# Altium schematic sheet 2_STM32F4.SchDoc
size Letter
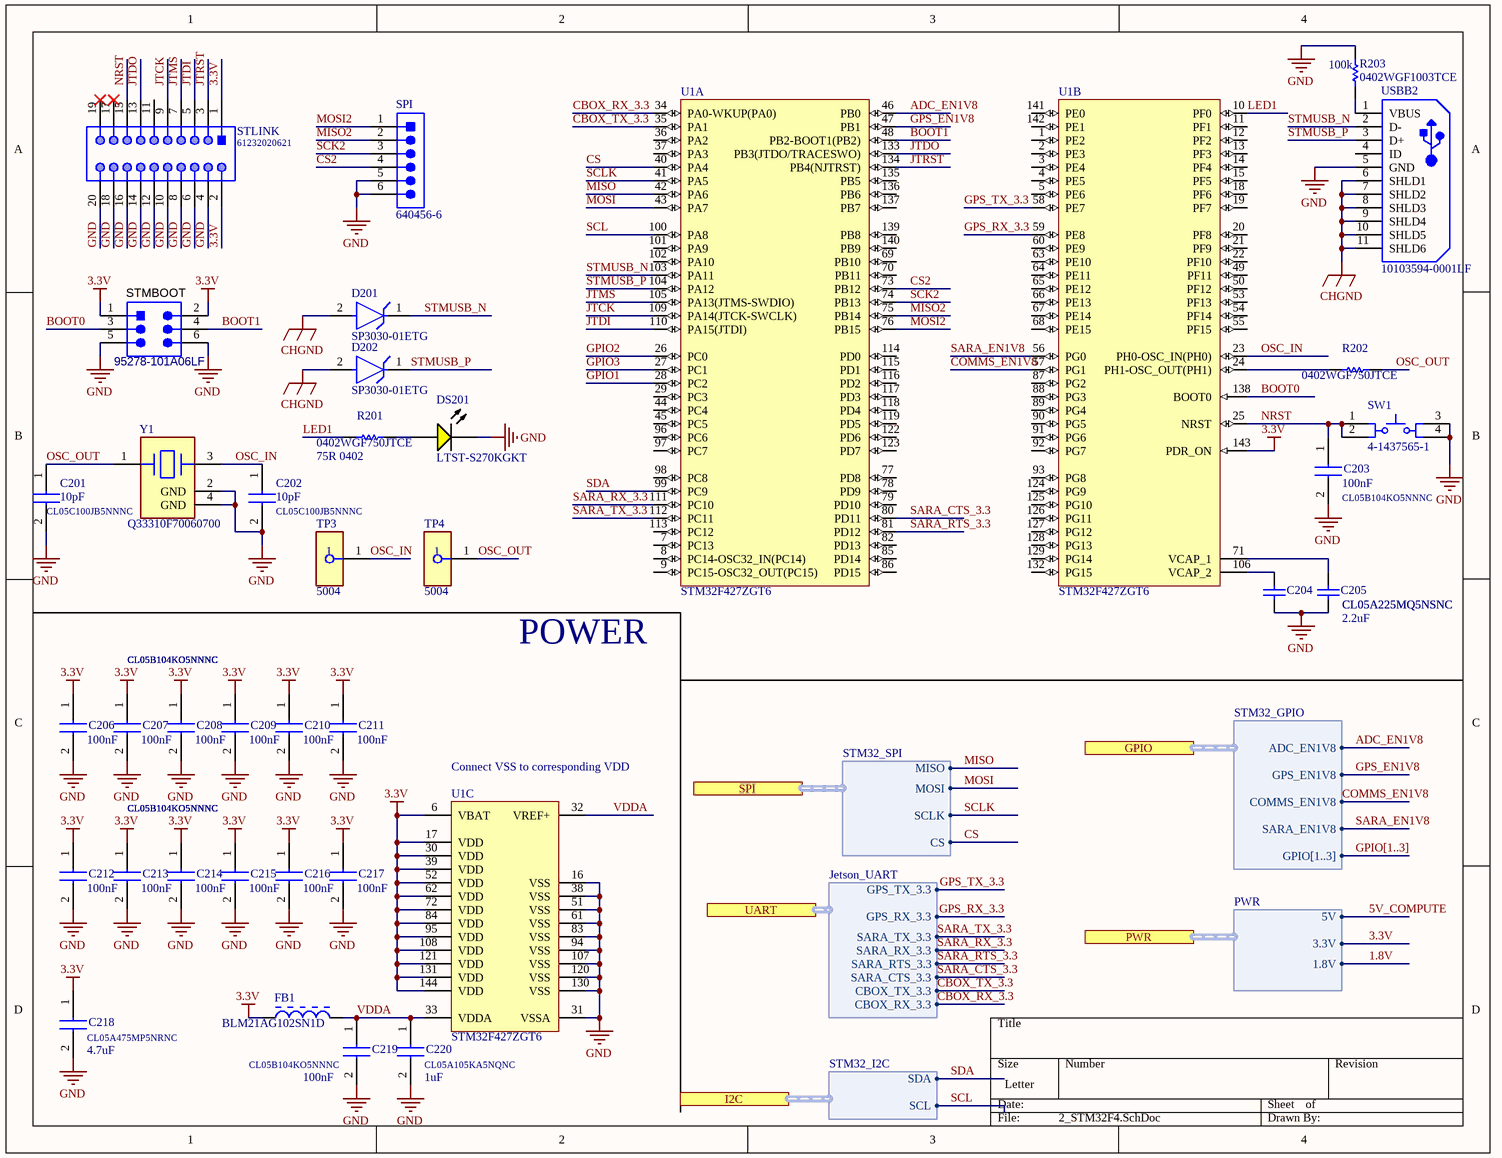
[diagram p0: 2_STM32F4.SchDoc]

## Parts
C201  CL05C100JB5NNNC  value 10pF  [CAPC1005X55N]
C202  CL05C100JB5NNNC  value 10pF  [CAPC1005X55N]
C203  CL05B104KO5NNNC  value 100nF  [CAPC1005X55N]
C204  CL05A225MQ5NSNC  [0402]
C205  CL05A225MQ5NSNC  [0402]
C206  CL05B104KO5NNNC  value 100nF  [CAPC1005X55N]
C207  CL05B104KO5NNNC  value 100nF  [CAPC1005X55N]
C208  CL05B104KO5NNNC  value 100nF  [CAPC1005X55N]
C209  CL05B104KO5NNNC  value 100nF  [CAPC1005X55N]
C210  CL05B104KO5NNNC  value 100nF  [CAPC1005X55N]
C211  CL05B104KO5NNNC  value 100nF  [CAPC1005X55N]
C212  CL05B104KO5NNNC  value 100nF  [CAPC1005X55N]
C213  CL05B104KO5NNNC  value 100nF  [CAPC1005X55N]
C214  CL05B104KO5NNNC  value 100nF  [CAPC1005X55N]
C215  CL05B104KO5NNNC  value 100nF  [CAPC1005X55N]
C216  CL05B104KO5NNNC  value 100nF  [CAPC1005X55N]
C217  CL05B104KO5NNNC  value 100nF  [CAPC1005X55N]
C218  CL05A475MP5NRNC  value 4.7uF  [CAPC1005X55N]
C219  CL05B104KO5NNNC  value 100nF  [CAPC1005X55N]
C220  CL05A105KA5NQNC  value 1uF  [CAPC1005X55N]
D201  SP3030-01ETG  [FP-SP3030-MFG]
D202  SP3030-01ETG  [FP-SP3030-MFG]
DS201  LTST-S270KGKT  [AVAG-HSMX-C190_V]
FB1  BLM21AG102SN1D  [MURA-BLM21-H1-CHIP-2_V]
R201  0402WGF750JTCE  [RESC1005X40X25ML05T10]
R202  0402WGF750JTCE  [RESC1005X40X25ML05T10]
R203  0402WGF1003TCE  [0402]
SPI  640456-6  [TECO-640456-6_V]
STLINK  61232020621  [61232020621]
STMBOOT  95278-101A06LF  [AMPM-95278-101A06LF_V]
SW1  4-1437565-1  [TECO-4-1437565-1_V]
TP3  5004  [FP-5004-MFG]
TP4  5004  [FP-5004-MFG]
U1  STM32F427ZGT6  [STM-LQFP144_V]  (parts A,B,C of 3)
USBB2  10103594-0001LF  [FCI-10103594-0001LF_V]
Y1  Q33310F70060700  [FP-7M-MFG]

## Ports
GPIO (harness STM32_GPIO), I2C (harness STM32_I2C), PWR (harness PWR), SPI (harness STM32_SPI), UART (harness Jetson_UART)

## Harnesses
STM32_I2C: SDA, SCL
STM32_SPI: MISO, MOSI, SCLK, CS
STM32_GPIO: ADC_EN1V8, GPS_EN1V8, COMMS_EN1V8, SARA_EN1V8, GPIO[1..3]
PWR: 5V, 3.3V, 1.8V
Jetson_UART: GPS_TX_3.3, GPS_RX_3.3, SARA_TX_3.3, SARA_RX_3.3, CBOX_TX_3.3, CBOX_RX_3.3, SARA_RTS_3.3, SARA_CTS_3.3

## Nets
3.3V: C206.1 C207.1 C208.1 C209.1 C210.1 C211.1 C212.1 C213.1 C214.1 C215.1 C216.1 C217.1 C218.1 FB1.1 STLINK.1 STLINK.2 STMBOOT.1 STMBOOT.2 U1.6(VBAT) U1.17(VDD) U1.30(VDD) U1.39(VDD) U1.52(VDD) U1.62(VDD) U1.72(VDD) U1.84(VDD) U1.95(VDD) U1.108(VDD) U1.121(VDD) U1.131(VDD) U1.143(PDR_ON) U1.144(VDD) ; port PWR.3.3V
CHGND: D201.2(A) D202.2(A) USBB2.6(SHLD1) USBB2.7(SHLD2) USBB2.8(SHLD3) USBB2.9(SHLD4) USBB2.10(SHLD5) USBB2.11(SHLD6)
GND: C201.2 C202.2 C203.2 C204.1 C205.1 C206.2 C207.2 C208.2 C209.2 C210.2 C211.2 C212.2 C213.2 C214.2 C215.2 C216.2 C217.2 C218.2 C219.2 C220.2 DS201.2(K) R203.2 SPI.5 SPI.6 STLINK.4 STLINK.6 STLINK.8 STLINK.10 STLINK.12 STLINK.14 STLINK.16 STLINK.18 STLINK.20 STMBOOT.5 STMBOOT.6 SW1.3 SW1.4 U1.16(VSS) U1.31(VSSA) U1.38(VSS) U1.51(VSS) U1.61(VSS) U1.83(VSS) U1.94(VSS) U1.107(VSS) U1.120(VSS) U1.130(VSS) USBB2.5(GND) Y1.2(GND) Y1.4(GND)
1.8V: port PWR.1.8V
5V_COMPUTE: port PWR.5V
ADC_EN1V8: U1.46(PB0) ; port GPIO.ADC_EN1V8
BOOT0: STMBOOT.3 U1.138(BOOT0)
BOOT1: STMBOOT.4 U1.48(PB2-BOOT1(PB2))
CBOX_RX_3.3: U1.34(PA0-WKUP(PA0)) ; port UART.CBOX_RX_3.3
CBOX_TX_3.3: U1.35(PA1) ; port UART.CBOX_TX_3.3
COMMS_EN1V8: U1.57(PG1) ; port GPIO.COMMS_EN1V8
CS: U1.40(PA4) ; port SPI.CS
CS2: SPI.4 U1.73(PB12)
GPIO1: U1.28(PC2)
GPIO2: U1.26(PC0)
GPIO3: U1.27(PC1)
GPS_EN1V8: U1.47(PB1) ; port GPIO.GPS_EN1V8
GPS_RX_3.3: U1.59(PE8) ; port UART.GPS_RX_3.3
GPS_TX_3.3: U1.58(PE7) ; port UART.GPS_TX_3.3
JTCK: STLINK.9 U1.109(PA14(JTCK-SWCLK))
JTDI: STLINK.5 U1.110(PA15(JTDI))
JTDO: STLINK.13 U1.133(PB3(JTDO/TRACESWO))
JTMS: STLINK.7 U1.105(PA13(JTMS-SWDIO))
JTRST: STLINK.3 U1.134(PB4(NJTRST))
LED1: R201.2 U1.10(PF0)
MISO: U1.42(PA6) ; port SPI.MISO
MISO2: SPI.2 U1.75(PB14)
MOSI: U1.43(PA7) ; port SPI.MOSI
MOSI2: SPI.1 U1.76(PB15)
NRST: C203.1 STLINK.15 SW1.1 SW1.2 U1.25(NRST)
OSC_IN: C202.1 TP3.1 U1.23(PH0-OSC_IN(PH0)) Y1.3
OSC_OUT: C201.1 R202.1 TP4.1 Y1.1
SARA_CTS_3.3: U1.80(PD11) ; port UART.SARA_CTS_3.3
SARA_EN1V8: U1.56(PG0) ; port GPIO.SARA_EN1V8
SARA_RTS_3.3: U1.81(PD12) ; port UART.SARA_RTS_3.3
SARA_RX_3.3: U1.111(PC10) ; port UART.SARA_RX_3.3
SARA_TX_3.3: U1.112(PC11) ; port UART.SARA_TX_3.3
SCK2: SPI.3 U1.74(PB13)
SCL: U1.100(PA8) ; port I2C.SCL
SCLK: U1.41(PA5) ; port SPI.SCLK
SDA: U1.99(PC9) ; port I2C.SDA
STMUSB_N: D201.1(C) U1.103(PA11) USBB2.2(D-)
STMUSB_P: D202.1(C) U1.104(PA12) USBB2.3(D+)
VDDA: C219.1 C220.1 FB1.2 U1.32(VREF+) U1.33(VDDA)
NetC204_2: C204.2 U1.106(VCAP_2)
NetC205_2: C205.2 U1.71(VCAP_1)
NetDS201_1: DS201.1(A) R201.1
NetR202_2: R202.2 U1.24(PH1-OSC_OUT(PH1))
NetR203_1: R203.1 USBB2.1(VBUS)

Not connected (* = marked no-connect by the designer): STLINK 11 17* 19*; U1 1(PE2) 2(PE3) 3(PE4) 4(PE5) 5(PE6) 7(PC13) 8(PC14-OSC32_IN(PC14)) 9(PC15-OSC32_OUT(PC15)) 11(PF1) 12(PF2) 13(PF3) 14(PF4) 15(PF5) 18(PF6) 19(PF7) 20(PF8) 21(PF9) 22(PF10) 29(PC3) 36(PA2) 37(PA3) 44(PC4) 45(PC5) 49(PF11) 50(PF12) 53(PF13) 54(PF14) 55(PF15) 60(PE9) 63(PE10) 64(PE11) 65(PE12) 66(PE13) 67(PE14) 68(PE15) 69(PB10) 70(PB11) 77(PD8) 78(PD9) 79(PD10) 82(PD13) 85(PD14) 86(PD15) 87(PG2) 88(PG3) 89(PG4) 90(PG5) 91(PG6) 92(PG7) 93(PG8) 96(PC6) 97(PC7) 98(PC8) 101(PA9) 102(PA10) 113(PC12) 114(PD0) 115(PD1) 116(PD2) 117(PD3) 118(PD4) 119(PD5) 122(PD6) 123(PD7) 124(PG9) 125(PG10) 126(PG11) 127(PG12) 128(PG13) 129(PG14) 132(PG15) 135(PB5) 136(PB6) 137(PB7) 139(PB8) 140(PB9) 141(PE0) 142(PE1); USBB2 4(ID)

## Buses and harness runs
bus GPIO[1..3]

## Notes on the sheet
- (near R203) 100k
- (near R201) 75R 0402
- (near C205) 2.2uF
- POWER
- (near U1) Connect VSS to corresponding VDD

## Library data of the parts
C201 C202 = C0402C560K5RACTU: 10pF 0402; Manufacturer_Name: Kemet; Datasheet Link: https://content.kemet.com/datasheets/KEM_C1002_X7R_SMD.pdf; Height: 0.55mm; Manufacturer_Part_Number: C0402C560K5RACTU; Arrow Part Number: C0402C560K5RACTU; Mouser Part Number: 80-C0402C560K5RACTU; Mouser Price/Stock: https://www.mouser.co.uk/ProductDetail/KEMET/C0402C560K5RACTU?qs=gt1LBUVyoHmQZW5v3ySgNQ%3D%3D
C203 C206-C220 = C0402C560K5RACTU: 100nF 0402; Manufacturer_Name: Kemet; Datasheet Link: https://content.kemet.com/datasheets/KEM_C1002_X7R_SMD.pdf; Height: 0.55mm; Manufacturer_Part_Number: C0402C560K5RACTU; Arrow Part Number: C0402C560K5RACTU; Mouser Part Number: 80-C0402C560K5RACTU; Mouser Price/Stock: https://www.mouser.co.uk/ProductDetail/KEMET/C0402C560K5RACTU?qs=gt1LBUVyoHmQZW5v3ySgNQ%3D%3D
C204 C205 = Cap: 2.2uF 0402; Published: 8-Jun-2000; LatestRevisionDate: 17-Jul-2002; LatestRevisionNote: Re-released for DXP Platform.; PackageReference: RAD-0.3; Publisher: Altium Limited; PackageDescription: Radial Cap, Thru-Hole; 2 Leads; 0.3 in Pin Spacing
D201 D202 = CMP-08607-000070-1: TVS DIODE 5V 10V SOD882; Manufacturer: Littelfuse; Max Junction Temp: +150°C; Automotive Grade: Grade 1; Direction: Unidirectional; Peak Pulse Current: 3A; Capacitance: 0.5pF; Value: 0.5pF; Number Of Channels: 1; Manufacturer Part Number: SP3030-01ETG; Temperature Range Low: -40°C; Lead Free: Yes; Package: SP3030; Device Class L2: TVS Diodes; Height: 0.6mm; ComponentLink2URL: https://www.littelfuse.com/~/media/electronics/datasheets/tvs_diode_arrays/littelfuse_tvs_diode_array_sp3030_datasheet.pdf.pdf; Device Class L3: unset; Category: Diode; Reverse Standoff Voltage: 5V; RoHS: TRUE; Digikey Description: TVS DIODE 5V 10V SOD882; Octopart: https://octopart.com/sp3030-01etg-littelfuse-29687287; ComponentLink2Description: Datasheet; Device Class L1: Circuit Protection; Automotive: Yes; Temperature: -40°C to +125°C; Temperature Range High: +125°C; Clamping Voltage: 10V; Mouser Description: TVS Diodes / ESD Suppressors 5V 1uA 22kV UNIDIRECTIONAL
DS201 = CMP-1744-00003-1: LED Uni-Color Yellow, 65 mW, 20 mA, -40 to 85 degC, 2-Pin SMD, RoHS, Tape and Reel; Tolerance: 1%; Voltage Rating: 50 V; Power Rating: 100 mW; Case\Package: 0603; Resistance: 390 Ohm; Min Operating Temperature: -55 degC; Length: 1.6 mm; ComponentLink3Description: Package Specification; Mount: Surface Mount; PackageReference: HSMX-C190; ComponentLink2Description: Datasheet; DatasheetVersion: Mar-12; Case Code (Metric): 1608; Pins: 2; Package Quantity: 5000; ComponentLink2URL: http://docs.avagotech.com/docs/AV02-0551EN; ComponentLink1Description: Manufacturer URL; RoHSCompliant: true; Packaging: Tape and Reel; PackageDescription: 2-Pin Surface Mount Device, Body 1.6 x 0.8 mm, Height 0.9 mm; REACH SVHC: No SVHC; ComponentLink3URL: http://www.fairchildsemi.com/dwg/MA/MA03D.pdf; Voltage Rating (DC): 50 V; Width: 0.8 mm; ComponentLink1URL: http://www.avagotech.com/; Max Operating Temperature: 155 degC; Case Code (Imperial): 0603; Height: 0.45 mm
FB1 = CMP-0686-00665-2: Chip Ferrite Bead for General Signal lines, 1000 Ohm, 500 mA, -55 to 125 degC, 2 x 1.25 x 1.05 mm SMD, Tape and Reel; Manufacturer: Murata; Impedance (at 100 MHz): 1000 Ohm +/- 25%; DC Resistance: 0.28 Ohm Max.; Rated Current: 500 mA; ComponentLink1Description: Manufacturer URL; PackageDescription: 2-Pin Chip, Body 2 x 1.25 mm; DatasheetVersion: 08/2013; PartNumber: BLM21AG102SN1D; Mounting Technology: Surface Mount; Operating Temperature Range: -55 to 125 degC; ComponentLink2URL: http://www.murata.com/products/catalog/pdf/c31e.pdf; ComponentLink3Description: Package Specification; ComponentLink2Description: Datasheet; Packing: Tape and Reel; ComponentLink3URL: http://www.murata.com/products/catalog/pdf/c31e.pdf; ComponentLink1URL: http://www.murata.com/; PackageReference: BLM21_H1050-2
R201 = CMP-2002-07344-1: 75R 0402; Part Number: RC0402FR-07100RL; Manufacturer: Yageo / Phycomp
R202 = CMP-2002-07344-1: 22R 0402; Part Number: RC0402FR-07100RL; Manufacturer: Yageo / Phycomp
R203 = Res1: 100k 0402; Published: 8-Jun-2000; LatestRevisionDate: 17-Jul-2002; LatestRevisionNote: Re-released for DXP Platform.; PackageReference: AXIAL-0.3; Publisher: Altium Limited; PackageDescription: Axial Device, Thru-Hole; 2 Leads; 0.3 in Pin Spacing
SPI = CMP-2000-05661-1: Male Header, Pitch 2.54 mm, 1 x 6 Position, Height 10.03 mm, Tail Length 3.56 mm, -55 to 105 degC, Bulk; Manufacturer: TE Connectivity; Contact Centerline Spacing: 0.100 / in.; Number of Contacts: 6; Current, Rating: 5 / A; Agency Approvals: CSA,UL; Material, Contact: CopperAlloy; Mounting Hole Size: 0.04 / "; Brand/Series: MTA-100Series; Pin Spacing: 0.1 / "; Mount Angle: Vertical; Contact Termination Area Plating: Tin; Angle: Straight; Primary Type: InterconnectSystem; Standards: RoHSCompliant,ELVCompliant,UL94V-0; Temperature, Operating: -55to+105 / °C; Material, Housing: Polyester; Special Features: Pinstrip; Color, Housing: White; Connector Type: MTA-100; Voltage, Rating: 250 / V; Termination: Solder; Package Reference: 640456-6; Size, Post: 0.025 / in.; Color: White; Datasheet URL: https://datasheet.ciiva.com/25618/0900766b80eb7fdd-25618163.pdf; Manufacturer URL: http://www.te.com/; Mounting Type: PCMount; Length, Pin: 0.14 / "; Type: PCBPlug; Length, Overall: 0.6 / "; Mounting Technology: ThroughHole; Number of Rows: 1; Contact Shape: Square; Contact Mating Area Plating: Tin; Datasheet Version: Rev. W, 05/2005; Number of Positions: 6; Package Description: Male Header, Pitch 2.54 mm, 1 x 6 Position, Height 10.03 mm, Tail Length 3.56 mm; Contact Plating: Tin; Length, Terminal Post: 0.14 / in.; Flammability Rating: UL94V-0
STLINK = CMP-1502-00063-1: Male Box Header WR-BHD, SMT, Vertical, pitch 2.54 mm, 20 pins; Manufacturer: Wurth Elektronik; Withstanding Voltage: 500VAC; Working Voltage: 250VAC; Pin Number: 20; Contact Resistance: 20mOhm; Pitch: 2.54mm; Datasheet URL: https://katalog.we-online.de/em/datasheet/6123xx20621.pdf; Gender: Male; Packaging: TapeandReel; Operating Temperature: -40to125degC; Mounting Technology: SMT; Orientation: Vertical; Published Date: August2018; Part Number: 61232020621; Manufacturer URL: http://www.we-online.de; Package Reference: 61232020621; Publisher: WurthElektronik
STMBOOT = CMP-1743-00002-1: Male Header, Pitch 2.54 mm, 2 x 3 Position, Height 14.4 mm, RoHS, Tape and Reel; Power Rating: 100 mW; Tolerance: 1%; Resistance: 49.9 Ohm; Case\Package: 0603; Voltage Rating: 50 V; DatasheetVersion: Rev. AC, 03/2016; PackageDescription: Male Header, Pitch 2.54 mm, 2 x 3 Position, Height 14.4 mm; REACH SVHC: No SVHC; Height: 0.45 mm; Mount: Surface Mount; Case Code (Imperial): 0603; Max Operating Temperature: 155 degC; Case Code (Metric): 1608; Packaging: Tape and Reel; RoHSCompliant: true; ComponentLink1Description: Datasheet; Min Operating Temperature: -55 degC; Length: 1.6 mm; Width: 0.8 mm; ComponentLink1URL: http://portal.fciconnect.com/Comergent//fci/drawing/95278.pdf; PackageReference: 95278-101A06LF
SW1 = CMP-2000-05602-1: Tactile Switch, 50 mA, 12 VDC, -20 to 85 degC, 4-Pin SMD, RoHS, Bulk; Manufacturer: TEConnectivity/AMPBrand; Illumination Type: N/R; Maximum Contact Resistance: 100mOhm; Actuator Style: RoundButton; Actuator Length: 1.4mm; Contact Rating @ Voltage: 0.05@12VDCA; Maximum DC Voltage Rating: 12V; Body Orientation: Straight; Ground Terminal: No; Dielectric Strength: 500VAC; Operating Force: 1.57N; Electrical Life: 100000Cycle; Mechanical Life: N/A; Family: FSMJSMA; Contact Material: CopperAlloy; Type: N/A; RoHS: Yes; Pole Throw Configuration: N/A; Operating Temperature: -20to85C; Minimum Insulation Resistance: 100MOhm; Package Description: 4-Pin Surface Mount Device, Body 6 x 6 mm, Pitch 9.1 mm; Housing Material: N/A; Switch Configuration: N/A; Mounting: SurfaceMount,GullWing; Datasheet URL: https://datasheet.ciiva.com/14635/0900766b80912216-14635826.pdf; Packaging: Bulk; Base Material: N/A; Actuator Color: N/A; Dimension: 6x10x5.25mm; Contact Plating: Silver; Seal Location: N/A; Mounting Technology: SurfaceMount; Part No: 4-1437565-1; Seal Description: N/A; Maximum AC Voltage Rating: N/A; Datasheet Version: 04/2007; Manufacturer URL: http://www.te.com/; Package Reference: 4-1437565-1; Product Weight: N/A
TP3 TP4 = CMP-2000-05575-2: PC TEST POINT MINIATURE YELLOW; Manufacturer: Keystone; Number Of Contacts: 1; Is Female: yes; Device Class L1: Connectors; Manufacturer Part Number: 5004; Digikey Description: PC TEST POINT MINIATURE YELLOW; ComponentLink2URL: https://www.keyelco.com/product-pdf.cfm?p=1313; Lead Free: Yes; ComponentLink2Description: Datasheet; Category: Conn; Height: 4.72mm; Octopart: https://octopart.com/5004-keystone-28591; Mouser Description: TEST POINT PC MINI .040"D YELLOW; Device Class L3: unset; Contact Material: Silver; Package: 5004; Automotive: No; Device Class L2: unset; RoHS: TRUE
U1 = CMP-0243-00054-2: ARM Cortex-M4 32-bit MCU+FPU, 210 DMIPS, 1024 kB Flash, 256 kB Internal RAM, 114 I/Os, 144-pin LQFP, -40 to 85 degC, Tray; Manufacturer: STMicroelectronics; I/Os (High Current): 114; Supply Voltage(Vcc) max (V): 3.6; FLASH Size (Prog) (kB): 1024; Supply Voltage(Vcc) min (V): 1.8; Internal RAM Size (kB): 256; D/A Converter: 2x12-bit; Operating Frequency(F) (Processor speed) (MHz): 168; Packing: Tray; ComponentLink2URL: http://www.st.com/st-web-ui/static/active/en/resource/technical/document/datasheet/DM00071990.pdf; ComponentLink2Description: Datasheet; ComponentLink3URL: http://www.st.com/st-web-ui/static/active/en/resource/technical/document/datasheet/DM00037051.pdf; ComponentLink1Description: Manufacturer URL; PackageReference: LQFP144; Core: ARM Cortex-M4; ComponentLink1URL: http://www.st.com/web/en/home.html; PackageDescription: 144-Pin Low Profile Quad Flat Package, 20 x 20 mm Body, 0.5 mm Pitch; Mounting Technology: Surface Mount; ComponentLink3Description: Package Specification; PackageVersion: Rev. 4, 06/2013; DatasheetVersion: Rev. 1; PartNumber: STM32F427ZGT6
USBB2 = CMP-1698-00007-1: Micro USB 2.0 B Receptacle, -55 to 85 degC, 5-Pin SMD, RoHS, Tape and Reel; Type (Resistor): Thick Film; Case\Package: 0603; Resistance: 4.7 kohm; Tolerance: 1%; Voltage Rating: 75 V; Power Rating: 100 mW; Case Code (Imperial): 0603; Case Code (Metric): 1608; REACH SVHC: Unknown; ComponentLink1URL: http://portal.fciconnect.com/; Package Quantity: 5000; RoHSCompliant: true; Max Operating Temperature: 155 degC; Min Operating Temperature: -55 degC; Mount: Surface Mount; Weight: 7.1E-05 oz; Length: 1.55 mm; PackageDescription: 5-Pin Surface Mount Device, Body 8.04 x 5.62 mm; Pins: 2; Height: 0.45 mm; ComponentLink2Description: Datasheet; ComponentLink2URL: http://portal.fciconnect.com/Comergent//fci/drawing/10103594.pdf; PackageReference: FCI-10103594-0001LF; DatasheetVersion: Rev. A, 06/2010; Width: 0.85 mm; Packaging: Tape and Reel; ComponentLink1Description: Manufacturer URL; LCSC Part #: *
Y1 = CMP-18717-000014-1: CRYSTAL 12.0000MHZ 15PF SMD; Load Capacitance: 12pF; Frequency Tolerance: 30ppm; Frequency: 32MHz; ESR (Equivalent Series Resistance): 60R; Max Operating Temperature: 85°C; Case/Package: SMD/SMT; Min Operating Temperature: -40°C; Mount: Surface Mount; Packaging: Tape and Reel; Frequency Stability: 30ppm; Width: 0.098inch; Length: 0.126inch; Package Quantity: 1; Lead Free: Lead Free; Height: 0.031inch